# EAGLE design energy_monitor (EAGLE 7.6.0)
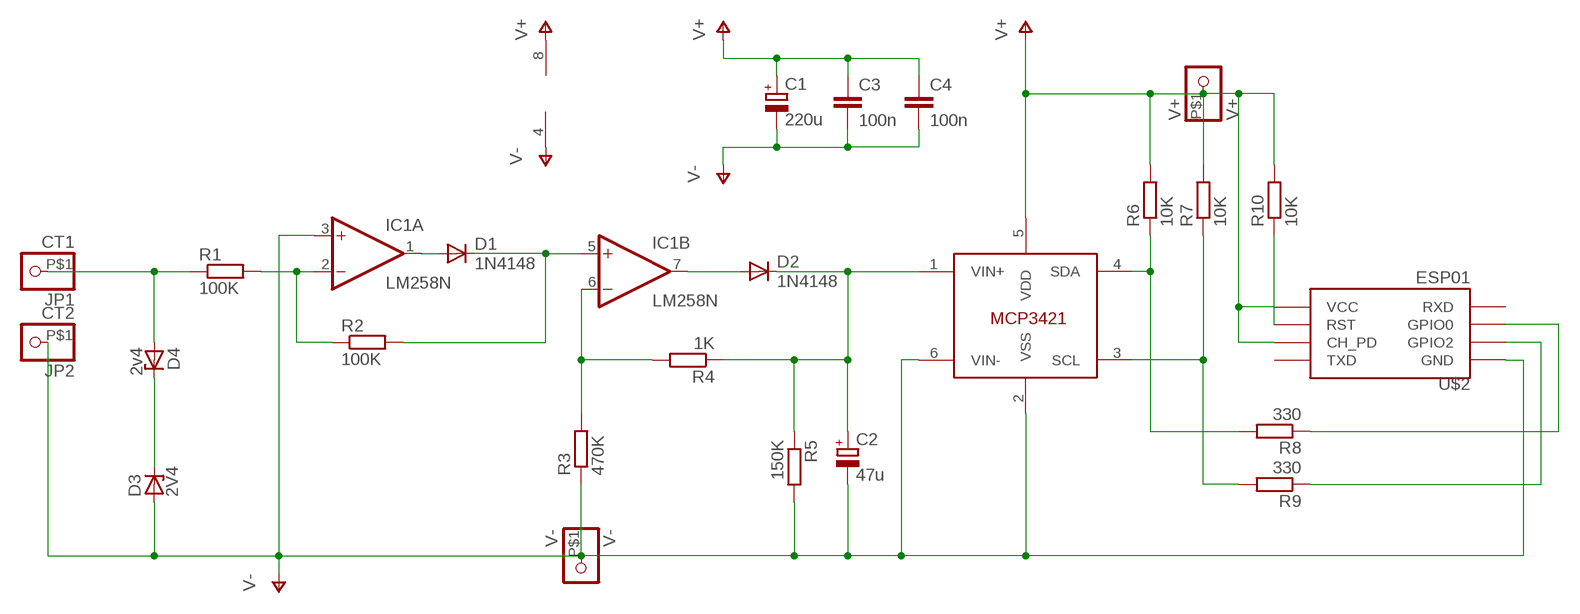
[diagram p0: schematic, sheet 1]

## Parts
C1  220u  CPOL-EUE2.5-6  [E2,5-6]
C2  47u  CPOL-EUE2-4  [E2-4]
C3  100n  C-EU050-045X075  [C050-045X075]
C4  100n  C-EU050-045X075  [C050-045X075]
D1  1N4148  1N4148DO35-7  [DO35-7]
D2  1N4148  1N4148DO35-7  [DO35-7]
D3  2V4  ZENER-DIODEDO34-7  [DO34Z7]
D4  2v4  ZENER-DIODEDO34-7  [DO34Z7]
IC1  LM258N  LM1458N  [DIL08]
JP1  CT1  PINHD-1X1-BIGPOGO  [1X1-BIGPOGO]
JP2  CT2  PINHD-1X1-BIGPOGO  [1X1-BIGPOGO]
R1  100K  R-EU_0204/7  [0204/7]
R2  100K  R-EU_0204/7  [0204/7]
R3  470K  R-EU_0204/7  [0204/7]
R4  1K  R-EU_0204/7  [0204/7]
R5  150K  R-EU_0204/7  [0204/7]
R6  10K  R-EU_0204/7  [0204/7]
R7  10K  R-EU_0204/7  [0204/7]
R8  330  R-EU_0204/7  [0204/7]
R9  330  R-EU_0204/7  [0204/7]
R10  10K  R-EU_0204/7  [0204/7]
U$1  MCP3421ADAPTER  [DIL06]
U$2  ESP01  [ESP01]
V+  V+  PINHD-1X1-BIGPOGO  [1X1-BIGPOGO]
V-  V-  PINHD-1X1-BIGPOGO  [1X1-BIGPOGO]

## Nets
N$1: D4.A JP1.P$1 R1.1
N$2: IC1.2(A:-IN) R1.2 R2.1
N$3: D1.A IC1.1(A:OUT)
N$4: D1.C IC1.5(B:+IN) R2.2
N$5: D3.C D4.C
N$6: D2.A IC1.7(B:OUT)
N$7: C2.+ D2.C R4.1 R5.1 U$1.1(VIN+)
N$8: IC1.6(B:-IN) R3.2 R4.2
N$9: R6.1 R8.2 U$1.4(SDA)
N$10: R7.1 R9.2 U$1.3(SCL)
N$11: R10.1 U$2.RST
N$13: R8.1 U$2.GPIO0
N$14: R9.1 U$2.GPIO2
V+: C1.+ C3.1 C4.1 IC1.8(P:V+) R6.2 R7.2 R10.2 U$1.5(VDD) U$2.CH_PD U$2.VCC V+.P$1
V-: C1.- C2.- C3.2 C4.2 D3.A IC1.3(A:+IN) IC1.4(P:V-) JP2.P$1 R3.1 R5.2 U$1.2(VSS) U$1.6(VIN-) U$2.GND V-.P$1
Unconnected: U$2.RX(RXD) U$2.TX(TXD)

## Library data of the parts
C1 C2 = rcl:CPOL-EU: POLARIZED CAPACITOR, European symbol
C3 C4 = rcl:C-EU: CAPACITOR, European symbol
D1 D2 = diode:1N4148: DIODE high speed (Philips)
D3 D4 = diode:ZENER-DIODE: Z-Diode
IC1 = linear:*1458: OP AMP
JP1 JP2 V+ V- = adafruit:PINHD-1X1: Pin header 1x1 for 0.1" spacing With round pins
R1-R10 = rcl:R-EU_: RESISTOR, European symbol
U$1 = adafruit:MCP3421
U$2 = esp8266modules:ESP01: ESP8266 Wifi module 01

## Board
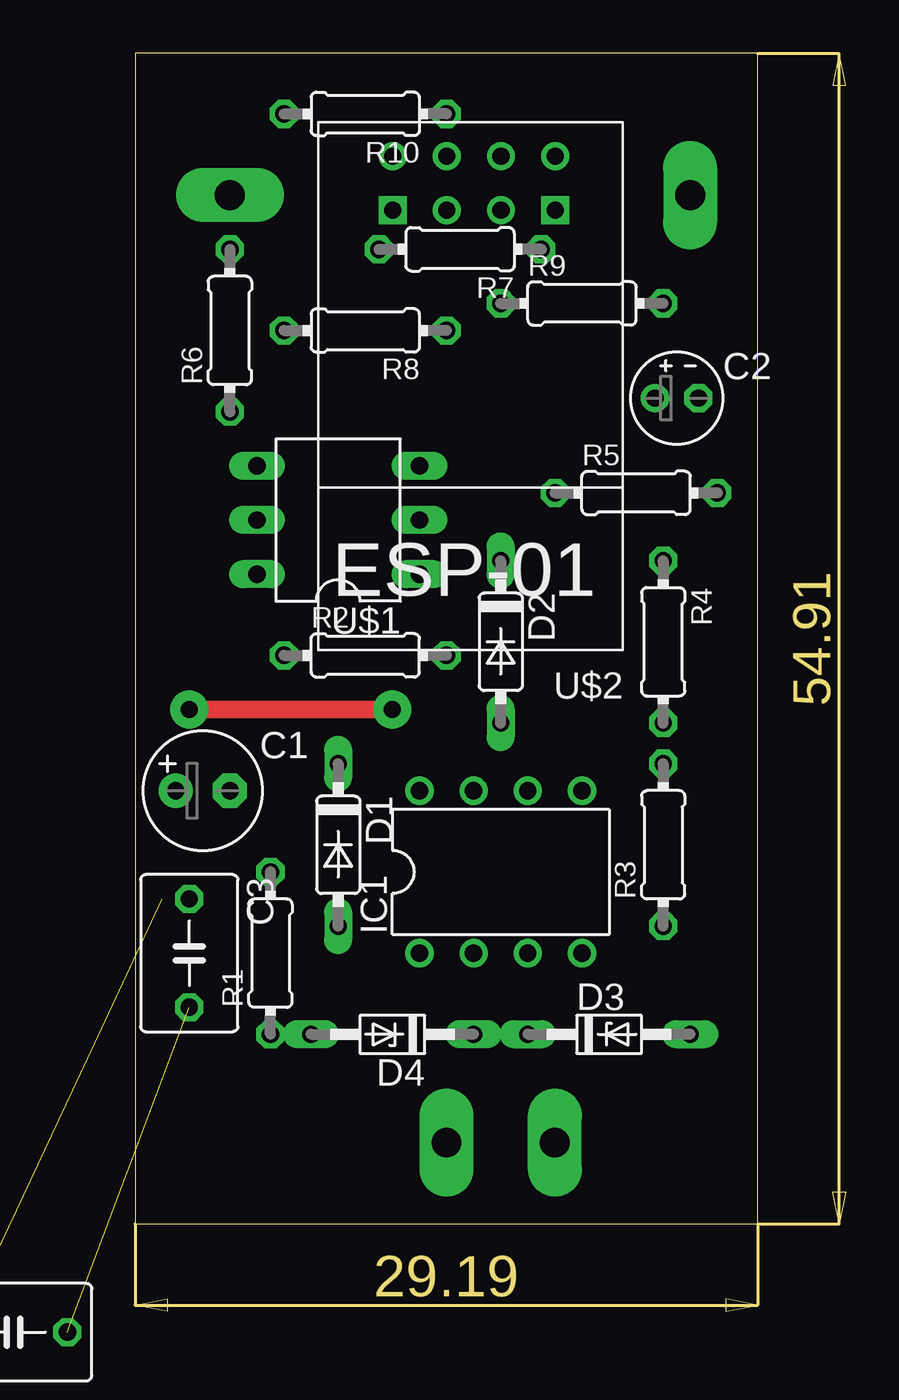
[diagram p1: board, top side]
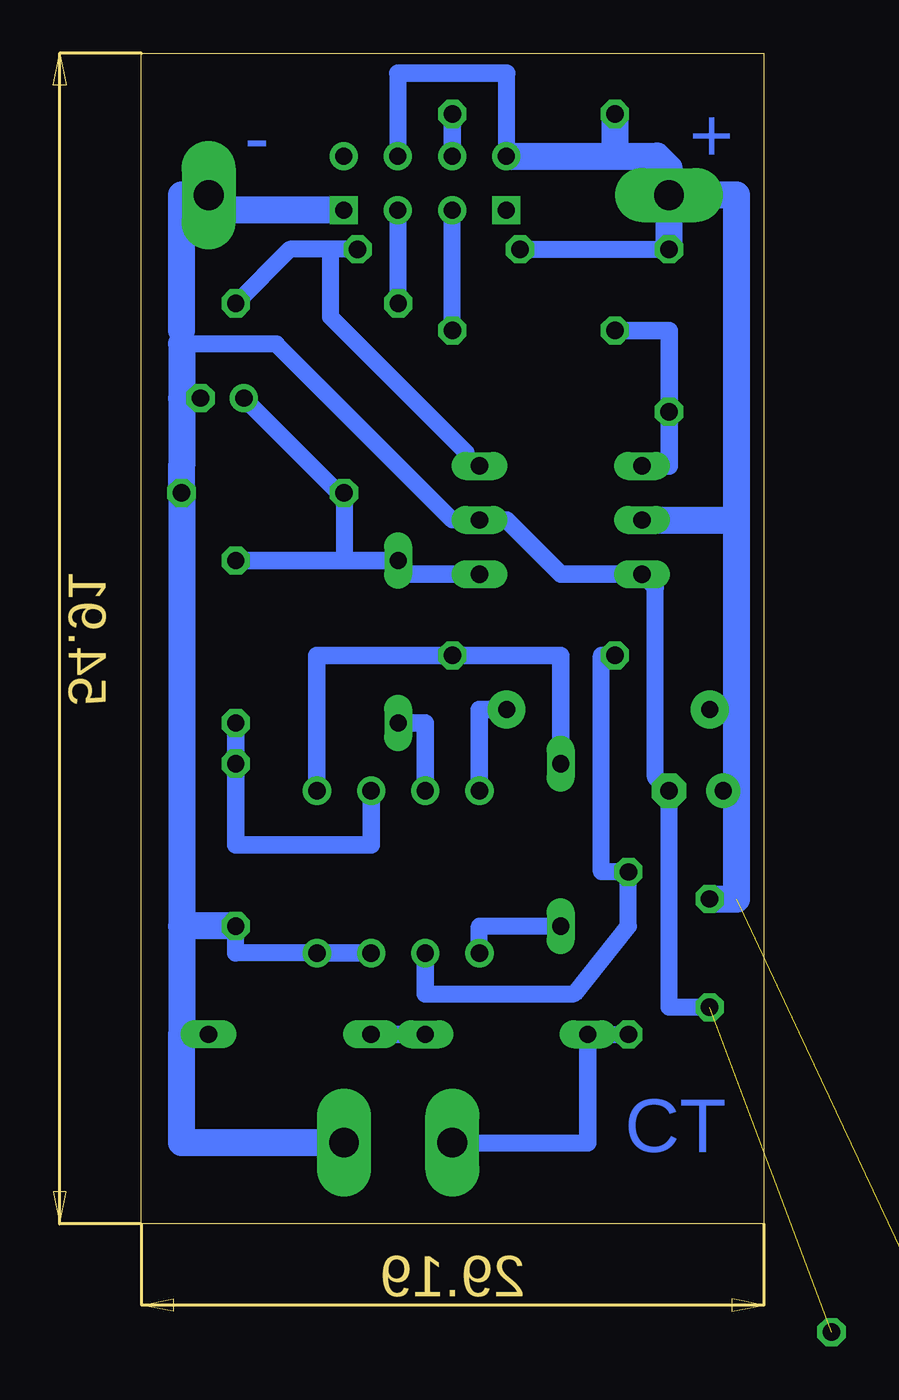
[diagram p2: board, bottom side, seen from below]

Size 29.19 x 54.91 mm. Coordinates in mm from the lower left corner, seen from the top.
Outline: 0,0 29.19,0 29.19,54.91 0,54.91 0,0
Copper layers (1*16): Top 0.035mm / dielectric 1.5mm / Bottom 0.035mm
Design rules "default *": minimum track width 0.3mm, minimum drill 24mil, track to track 8mil, track to pad 8mil, pad to pad 8mil, via to via 8mil, smd to smd 8mil, copper to edge 40mil, drill to drill 8mil, minimum pad ring 10mil, minimum via ring 8mil, stop-mask expansion 4mil, vias tented up to drill 0mil, thermal gap 10mil

### Footprints (pad centres in the part's own frame; a part is rotated, then mirrored left to right if it is on the bottom)
E2,5-6 = drill 0.813 pad 1.6: + -1.27,0 | drill 0.813 pad 1.6 octagon: - 1.27,0
E2-4 = drill 0.813 pad 1.27: + -1.016,0 | drill 0.813 pad 1.27 octagon: - 1.016,0
C050-045X075 = drill 0.813 octagon: 1 -2.54,0; 2 2.54,0
DO35-7 = drill 0.813 long: A 3.81,0; C -3.81,0
DO34Z7 = drill 0.813 long: A 3.81,0; C -3.81,0
DIL08 = drill 0.813 pad 1.27: 1 -3.81,-3.81; 2 -1.27,-3.81; 3 1.27,-3.81; 4 3.81,-3.81; 5 3.81,3.81; 6 1.27,3.81; 7 -1.27,3.81; 8 -3.81,3.81
1X1-BIGPOGO = drill 1.4 pad 2.54 long: P$1 0,0
0204/7 = drill 0.813 octagon: 1 -3.81,0; 2 3.81,0
DIL06 = drill 0.813 long: 1 -3.81,-3.81; 2 -1.27,-3.81; 3 1.27,-3.81; 4 1.27,3.81; 5 -1.27,3.81; 6 -3.81,3.81
ESP01 = drill 0.8: CH_PD -1.285,-8.178; GPIO0 1.255,-5.638; GPIO2 -1.285,-5.638; RST 1.255,-8.178; TX -3.825,-8.178; VCC 3.795,-8.178 | drill 0.8 square: GND -3.825,-5.638; RX 3.795,-5.638

### Placement (x,y rotation side)
C1  3.18,20.32 0 top
C2  25.4,38.73 0 top
C3  2.54,12.7 270 top
C4  -5.71,-5.08 0 top  (outside the outline)
D1  9.53,17.78 270 top
D2  17.14,27.3 270 top
D3  22.23,8.89 0 top
D4  12.07,8.89 180 top
IC1  17.14,16.51 0 top
JP1  14.61,3.81 90 top
JP2  19.68,3.81 90 top
R1  6.35,12.7 90 top
R2  10.79,26.67 0 top
R3  24.77,17.78 90 top
R4  24.77,27.3 270 top
R5  23.5,34.29 0 top
R6  4.45,41.91 90 top
R7  15.24,45.72 180 top
R8  10.79,41.91 180 top
R9  20.96,43.18 0 top
R10  10.79,52.07 180 top
U$1  9.53,34.29 90 top
U$2  15.88,41.91 180 top
V+  4.45,48.26 180 top
V-  26.04,48.26 270 top

### Tracks (layer width: path | path; a pad name or v marks a point on that pad's centre or on a via)
N$1
  Bottom 0.8: JP1.P$1 8.26,3.81 | D4.A R1.1
  Bottom 0.813: 8.26,3.81 D4.A
N$2
  Bottom 0.8: 15.88,10.79 8.89,10.79 6.35,13.97 R1.2 7.62,16.51 7.62,26.67 R2.1
  Bottom 0.813: IC1.2 15.88,10.79
N$3
  Bottom 0.8: IC1.1 13.34,13.97 D1.A
N$4
  Bottom 0.813: IC1.5 20.96,26.67 R2.2 9.53,26.67 D1.C
N$5
  Bottom 0.813: D4.C D3.C
N$6
  Bottom 0.813: IC1.7 15.88,23.5 D2.A
N$7
  Bottom 0.8: 19.68,31.11 R5.1 19.94,34.29 C2.+
  Bottom 0.813: R4.1 19.68,31.11 D2.C 17.14,30.48 U$1.1
N$8
  Bottom 0.813: R4.2 R3.2 24.77,17.78 18.41,17.78 IC1.6
N$9
  Bottom 0.813: U$1.4 4.45,35.56 R6.1 4.45,41.91 R8.2
N$10
  Bottom 0.8: R7.1 20.32,45.72 | 20.32,45.72 22.23,45.72 R9.2 | U$1.3 13.97,35.56 13.97,36.2 20.32,42.55 20.32,45.72
N$11
  Bottom 0.813: R10.1 U$2.RST
N$13
  Bottom 0.8: R8.1 14.61,47.53 U$2.GPIO0
N$14
  Bottom 0.8: R9.1 17.14,47.53 U$2.GPIO2
V+  (via drill 0.8 pad 1.78)  (1 unrouted)
  Top 0.813: v12.07,24.13 v2.54,24.13
  Bottom 0.8: R7.2 R6.2 | U$2.VCC 12.07,50.09 12.07,53.98 | 17.16,53.98 U$2.CH_PD | C1.+ 1.27,20.32
  Bottom 0.813: IC1.8 13.34,24.13 v12.07,24.13 | v2.54,24.13 1.27,24.13 | 12.07,53.98 17.16,53.98
  Bottom 1.27: 1.27,33.02 1.27,24.13 1.27,20.32 1.27,15.24 C3.1 | U$1.5 1.27,33.02 | 1.27,33.02 1.27,48.26 V+.P$1 | U$2.VCC 6.99,50.09 | 6.99,50.09 5,50.09 4.45,49.53 V+.P$1 | R6.2 V+.P$1 | R10.2 6.99,50.09
V-  (1 unrouted)
  Bottom 0.8: IC1.4 24.77,12.7 R3.1 | U$1.2 14.61,33.02 22.86,41.27 27.3,41.27 | 5.08,30.48 U$1.6 5.08,29.84 5.08,20.95 C1.- 4.45,10.16 C3.2
  Bottom 0.813: C2.- 27.3,38.73 | IC1.4 IC1.3 | U$1.6 9.53,30.48 12.07,33.02 U$1.2 | 27.3,41.91 27.3,41.27
  Bottom 1.27: JP2.P$1 27.3,3.81 27.3,8.89 | 27.3,8.89 D3.A | R3.1 27.3,13.97 | 27.3,13.97 27.3,8.89 | 27.3,13.97 R5.2 27.3,35.56 27.3,38.73 27.3,41.27 | U$2.GND 25.32,47.55 V-.P$1 27.3,48.26 27.3,41.91

### Text on the board
Bottom: + | - | CT